# EAGLE schematic AQPCB (EAGLE 9.6.2)
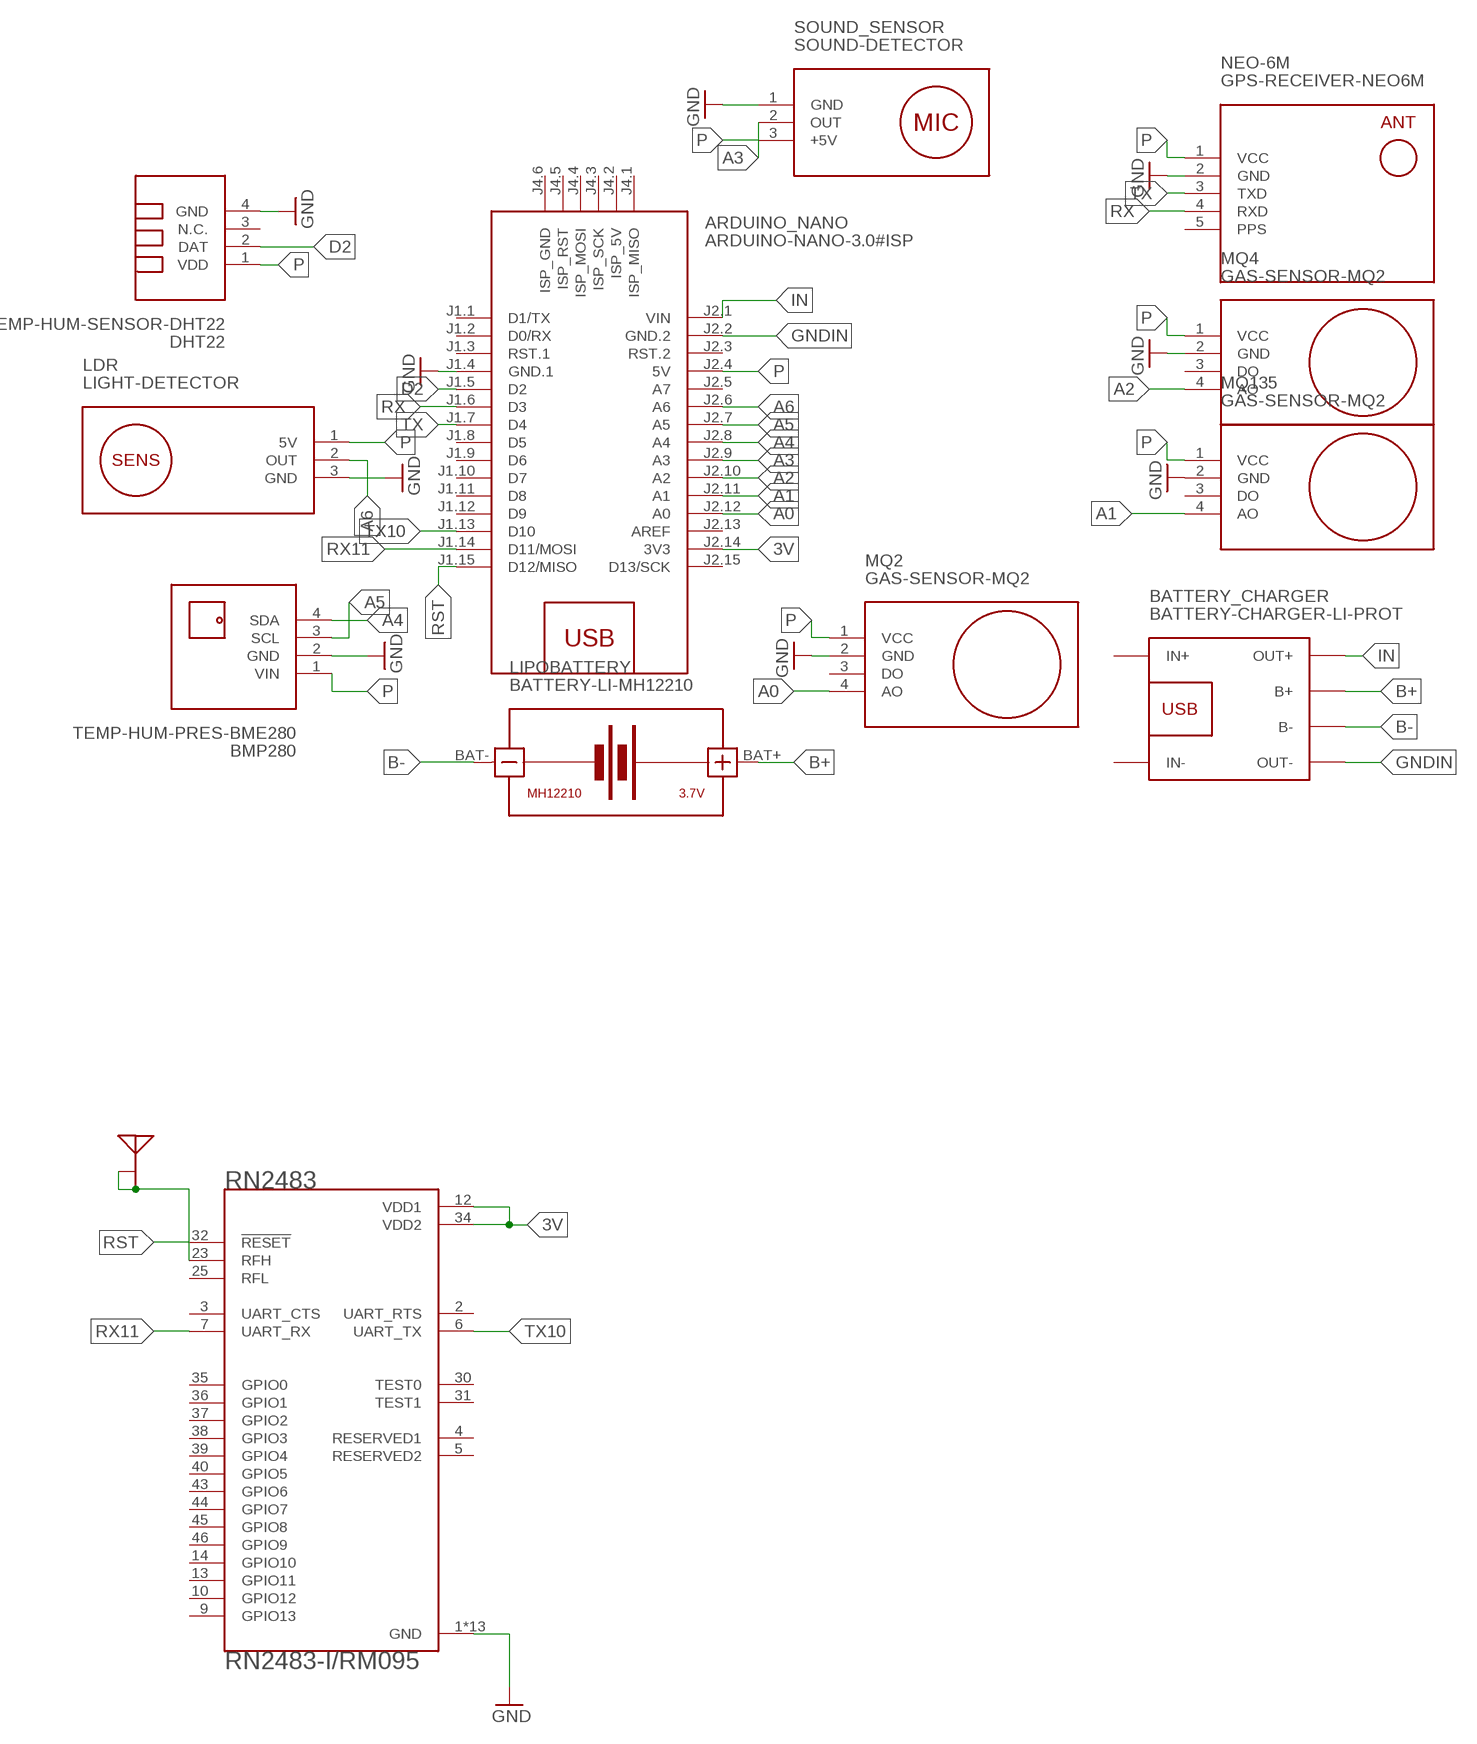
[diagram p0: schematic, sheet 1]

## Parts
ANTENNA  CHIP  [2450AT18B100]
ARDUINO_NANO  ARDUINO-NANO-3.0#ISP  [ARDUINO-NANO-3.0#ISP]
BATTERY_CHARGER  BATTERY-CHARGER-LI-PROT  [BATTERY-CHARGER-LI-PROT]
BMP280  TEMP-HUM-PRES-BME280  [TEMP-HUM-PRES-BME280]
DHT22  TEMP-HUM-SENSOR-DHT22  [TEMP-HUM-SENSOR-DHT22]
LDR  LIGHT-DETECTOR  [LIGHT-DETECTOR]
LIPOBATTERY  BATTERY-LI-MH12210  [BATTERY-LI-MH12210]
MQ2  GAS-SENSOR-MQ2  [GAS-SENSOR-MQ2]
MQ4  GAS-SENSOR-MQ2  [GAS-SENSOR-MQ2]
MQ135  GAS-SENSOR-MQ2  [GAS-SENSOR-MQ2]
NEO-6M  GPS-RECEIVER-NEO6M  [GPS-RECEIVER-NEO6M]
RN2483  RN2483-I/RM095  [MICROCHIP_RN2483-I/RM095]
SOUND_SENSOR  SOUND-DETECTOR  [SOUND-DETECTOR]

## Nets
3V: ARDUINO_NANO.J2.14(3V3) RN2483.12(VDD1) RN2483.34(VDD2)
A0: ARDUINO_NANO.J2.12(A0) MQ2.4(AO)
A1: ARDUINO_NANO.J2.11(A1) MQ135.4(AO)
A2: ARDUINO_NANO.J2.10(A2) MQ4.4(AO)
A3: ARDUINO_NANO.J2.9(A3) SOUND_SENSOR.2(OUT)
A4: ARDUINO_NANO.J2.8(A4) BMP280.4(SDA)
A5: ARDUINO_NANO.J2.7(A5) BMP280.3(SCL)
A6: ARDUINO_NANO.J2.6(A6) LDR.2(OUT)
B+: BATTERY_CHARGER.B+ LIPOBATTERY.BAT+
B-: BATTERY_CHARGER.B- LIPOBATTERY.BAT-
D2: ARDUINO_NANO.J1.5(D2) DHT22.2(DAT)
GND: ARDUINO_NANO.J1.4(GND.1) BMP280.2(GND) DHT22.4(GND) LDR.3(GND) MQ2.2(GND) MQ4.2(GND) MQ135.2(GND) NEO-6M.2(GND) RN2483.1(GND) RN2483.8(GND) RN2483.11(GND) RN2483.20(GND) RN2483.21(GND) RN2483.22(GND) RN2483.24(GND) RN2483.26(GND) RN2483.27(GND) RN2483.28(GND) RN2483.33(GND) RN2483.41(GND) RN2483.47(GND) SOUND_SENSOR.1(GND)
GNDIN: ARDUINO_NANO.J2.2(GND.2) BATTERY_CHARGER.OUT-
IN: ARDUINO_NANO.J2.1(VIN) BATTERY_CHARGER.OUT+
N$1: ANTENNA.FEED ANTENNA.GND RN2483.23(RFH)
P: ARDUINO_NANO.J2.4(5V) BMP280.1(VIN) DHT22.1(VDD) LDR.1(5V) MQ2.1(VCC) MQ4.1(VCC) MQ135.1(VCC) NEO-6M.1(VCC) SOUND_SENSOR.3(+5V)
RST: ARDUINO_NANO.J1.15(D12/MISO) RN2483.32(!RESET)
RX: ARDUINO_NANO.J1.6(D3) NEO-6M.4(RXD)
RX11: ARDUINO_NANO.J1.14(D11/MOSI) RN2483.7(UART_RX)
TX: ARDUINO_NANO.J1.7(D4) NEO-6M.3(TXD)
TX10: ARDUINO_NANO.J1.13(D10) RN2483.6(UART_TX)
Unconnected: ARDUINO_NANO.J1.1(D1/TX) ARDUINO_NANO.J1.2(D0/RX) ARDUINO_NANO.J1.3(RST.1) ARDUINO_NANO.J1.8(D5) ARDUINO_NANO.J1.9(D6) ARDUINO_NANO.J1.10(D7) ARDUINO_NANO.J1.11(D8) ARDUINO_NANO.J1.12(D9) ARDUINO_NANO.J2.3(RST.2) ARDUINO_NANO.J2.5(A7) ARDUINO_NANO.J2.13(AREF) ARDUINO_NANO.J2.15(D13/SCK) ARDUINO_NANO.J4.1(ISP_MISO) ARDUINO_NANO.J4.2(ISP_5V) ARDUINO_NANO.J4.3(ISP_SCK) ARDUINO_NANO.J4.4(ISP_MOSI) ARDUINO_NANO.J4.5(ISP_RST) ARDUINO_NANO.J4.6(ISP_GND) BATTERY_CHARGER.IN+ BATTERY_CHARGER.IN- DHT22.3(N.C.) MQ2.3(DO) MQ4.3(DO) MQ135.3(DO) RN2483.2(UART_RTS) RN2483.3(UART_CTS) RN2483.4(RESERVED1) RN2483.5(RESERVED2) RN2483.9(GPIO13) RN2483.10(GPIO12) RN2483.13(GPIO11) RN2483.14(GPIO10) RN2483.25(RFL) RN2483.30(TEST0) RN2483.31(TEST1) RN2483.35(GPIO0) RN2483.36(GPIO1) RN2483.37(GPIO2) RN2483.38(GPIO3) RN2483.39(GPIO4) RN2483.40(GPIO5) RN2483.43(GPIO6) RN2483.44(GPIO7) RN2483.45(GPIO8) RN2483.46(GPIO9)

## Power pins joined to a net without a drawn wire
PPS: NEO-6M.5(PPS)

## Library data of the parts
ANTENNA = Antennas:CHIP
ARDUINO_NANO = diy-modules:ARDUINO-NANO-3.0#ISP: Arduino Nano 3.0 (and compatible devices) with ISP pads More details available here: https://www.arduino.cc/en/Main/ArduinoBoardNano Click here to find device on ebay.com <http://www.ebay.com/sch/arduino+nano>
BATTERY_CHARGER = diy-modules:BATTERY-CHARGER-LI-PROT: Lithium Battery 5V Charger with protection circuit More details available here: http://www.instructables.com/id/DIY-Lithium-ion-Battery-Charger/step4/TP4056-based-lithium-ion-battery-charger-module/ Click here to find device on ebay.com <http://www.ebay.com/sch/tp4056+charger+usb+protection>
BMP280 = diy-modules:TEMP-HUM-PRES-BME280: Digital Humidity-Temperature-Pressure Sensor based on BME280 device More information about BME280 device is available here: https://www.bosch-sensortec.com/bst/products/all_products/bme280 Click here to find device on ebay.com <http://www.ebay.com/sch/bme280+breakout>
DHT22 = diy-modules:TEMP-HUM-SENSOR-DHT22: DHT22 - digital humidity & temperature sensor Also known as: AM2302 AM2302 datasheet available here: http://akizukidenshi.com/download/ds/aosong/AM2302.pdf Click here to find device on ebay.com <http://www.ebay.com/sch/dht22+digital+sensor>
LDR = diy-modules:LIGHT-DETECTOR: Light Detection Module
LIPOBATTERY = diy-modules:BATTERY-LI-MH12210: Lithium-Ion MH12210 Rechargeable Battery Panasonic NCR18650PF battery datasheet available here: https://industrial.panasonic.com/cdbs/www-data/pdf2/ACI4000/ACI4000C12.pdf Click here to find device on ebay.com <http://www.ebay.com/sch/ncr18650b+battery>
MQ2 MQ4 MQ135 = diy-modules:GAS-SENSOR-MQ2: Gas Sensor based on MQ-2 device Guide describing how to use MQ-2 sensor with Arduino is available here: http://www.instructables.com/id/How-to-use-MQ2-Gas-Sensor-Arduino-Tutorial/ MQ-2 sensor datasheet is available here: http://gas-sensor.ru/pdf/combustible-gas-sensor.pdf Click here to find device on ebay.com <http://www.ebay.com/sch/mq2+sensor+module+smoke>
NEO-6M = diy-modules:GPS-RECEIVER-NEO6M: GPS Receiver Module based on NEO-6 device Short tutorial how to use NEO-6 module with Arduino: http://www.xarg.org/2016/06/neo6mv2-gps-module-with-arduino/ NEO-6 datasheet is available here: https://www.u-blox.com/sites/default/files/products/documents/NEO-6_DataSheet_%28GPS.G6-HW-09005%29.pdf Click here to find device on ebay.com <http://www.ebay.com/sch/gyneo6mv2>
RN2483 = RN2483-I_RM095:RN2483-I/RM095: Sub-GHz Dual Band Long Range Transceiver LoRa Module Check prices <https://pricing.snapeda.com/parts/RN2483-I/RM095/Microchip/view-part?ref=eda>; AVAILABILITY: Bad; DESCRIPTION: Sub-GHz Dual Band Long Range Transceiver LoRa Module; MF: Microchip; MP: RN2483-I/RM095; PACKAGE: None; PRICE: None
SOUND_SENSOR = diy-modules:SOUND-DETECTOR: Sound Detection Module